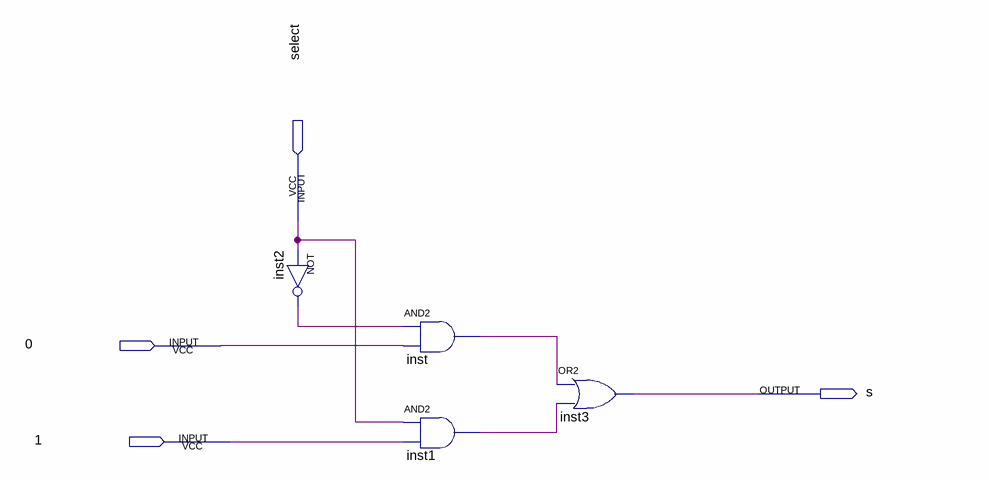
[diagram p0: schematic sheet]
// Quartus schematic muxin.bdf as structural Verilog: 4 symbols, 4 pins
module muxin (
  input  select,
  input  \0 ,
  input  \1 ,
  output s
);

  wire inst1_out, inst2_out, inst_out;

  not inst2 (inst2_out, select);
  and inst (inst_out, inst2_out, \0 );
  and inst1 (inst1_out, select, \1 );
  or inst3 (s, inst_out, inst1_out);
endmodule
